# Altium schematic sheet boxer_analog.SchDoc: RS485, Buzzer, 12V FAN
size A4; DrawnBy: Damian Dolewski; Engineer: Damian Dolewski; DocumentNumber: 4; SheetNumber: 4; SheetTotal: 7
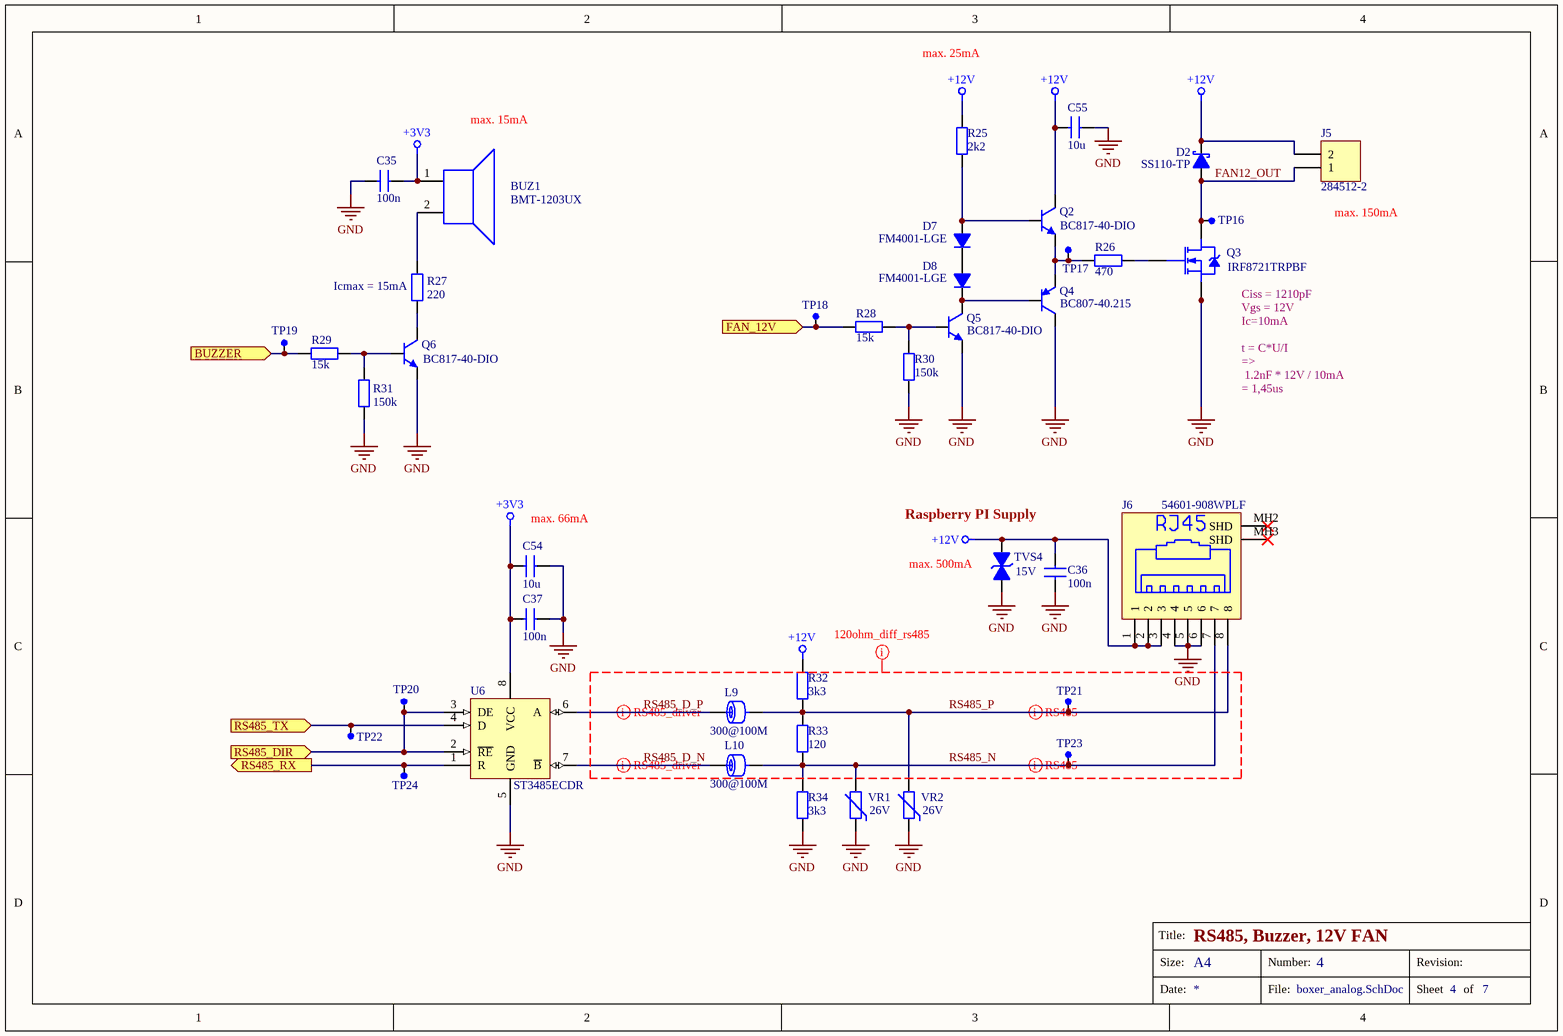
[diagram p0: boxer_analog.SchDoc]

## Parts
BUZ1  BMT-1203UX  [buzzer 7.6mm]
C35  value 100n  [C_0805]  (hidden comment: Capacitor)
C36  value 100n  [C_0805]  (hidden comment: Capacitor)
C37  value 100n  [C_0805]  (hidden comment: Capacitor)
C54  value 10u  [C_1206]  (hidden comment: TME: CL31A226MOCLNNC)
C55  value 10u  [C_1206]  (hidden comment: TME: CL31A226MOCLNNC)
D2  SS110-TP  [D_SMA]
D7  FM4001-LGE  [SOD123F]
D8  FM4001-LGE  [SOD123F]
J5  284512-2  [284512-2]
J6  54601-908WPLF  [RJ45_54601-908WPLF]
L9  value 300@100M  [L_0805]  (hidden comment: 742792031)
L10  value 300@100M  [L_0805]  (hidden comment: 742792031)
Q2  BC817-40-DIO  [SOT-23]
Q3  IRF8721TRPBF  [SO8]
Q4  BC807-40.215  [SOT-23]
Q5  BC817-40-DIO  [SOT-23]
Q6  BC817-40-DIO  [SOT-23]
R25  value 2k2  [R_0805]  (hidden comment: Resistor)
R26  value 470  [R_1206]  (hidden comment: Resistor)
R27  value 220  [R_0805]  (hidden comment: Resistor)
R28  value 15k  [R_0805]  (hidden comment: Resistor)
R29  value 15k  [R_0805]  (hidden comment: Resistor)
R30  value 150k  [R_0805]  (hidden comment: Resistor)
R31  value 150k  [R_0805]  (hidden comment: Resistor)
R32  value 3k3  [R_0805]  (hidden comment: Resistor)
R33  value 120  [R_0805]  (hidden comment: Resistor)
R34  value 3k3  [R_0805]  (hidden comment: Resistor)
TP16  TEST PAD  [PIN]  (value not drawn)
TP17  TEST PAD  [PIN]  (value not drawn)
TP18  TEST PAD  [PIN]  (value not drawn)
TP19  TEST PAD  [PIN]  (value not drawn)
TP20  TEST PAD  [PIN]  (value not drawn)
TP21  TEST PAD  [PIN]  (value not drawn)
TP22  TEST PAD  [PIN]  (value not drawn)
TP23  TEST PAD  [PIN]  (value not drawn)
TP24  TEST PAD  [PIN]  (value not drawn)
TVS4  value 15V  [D_SMB]  (hidden comment: SM6T15CA)
U6  ST3485ECDR  [SO8]
VR1  value 26V  [VR_0805]  (hidden comment: AMCV-0805-260-C800N-T)
VR2  value 26V  [VR_0805]  (hidden comment: AMCV-0805-260-C800N-T)

## Ports
BUZZER (in), FAN_12V (in), RS485_DIR (in), RS485_RX (out), RS485_TX (in)

## Nets
+3V3: BUZ1.1 C35.2 C37.1 C54.2 U6.8(VCC)
+12V: C36.1 C55.1 D2.2(K) J5.2 J6.1 J6.2 J6.3 Q2.3(C) R25.2 R32.2 TVS4.1(A)
GND: C35.1 C36.2 C37.2 C54.1 C55.2 J6.4 J6.5 J6.6 Q3.1(S) Q3.2(S) Q3.3(S) Q4.3(C) Q5.2(E) Q6.2(E) R30.1 R31.1 R34.1 TVS4.2(K) U6.5(GND) VR1.2 VR2.2
BUZZER: R29.1 TP19.1 ; port BUZZER
FAN12_OUT: D2.1(A) J5.1 Q3.5(D) Q3.6(D) Q3.7(D) Q3.8(D) TP16.1
FAN_12V: R28.1 TP18.1 ; port FAN_12V
RS485_D_N: L10.1 U6.7(~{B})
RS485_D_P: L9.1 U6.6(A)
RS485_DIR: TP20.1 U6.2(~{RE}) U6.3(DE) ; port RS485_DIR
RS485_N: J6.7 L10.2 R33.1 R34.2 TP23.1 VR1.1
RS485_P: J6.8 L9.2 R32.1 R33.2 TP21.1 VR2.1
RS485_RX: TP24.1 U6.1(R) ; port RS485_RX
RS485_TX: TP22.1 U6.4(D) ; port RS485_TX
NetBUZ1_2: BUZ1.2 R27.2
NetD7_1: D7.1(A) Q2.1(B) R25.1
NetD7_2: D7.2(K) D8.1(A)
NetD8_2: D8.2(K) Q4.1(B) Q5.3(C)
NetQ2_2: Q2.2(E) Q4.2(E) R26.2 TP17.1
NetQ3_4: Q3.4(G) R26.1
NetQ5_1: Q5.1(B) R28.2 R30.2
NetQ6_1: Q6.1(B) R29.2 R31.2
NetQ6_3: Q6.3(C) R27.1

Not connected (* = marked no-connect by the designer): J6 MH2(SHD)* MH3(SHD)*

## Layout directives
differential pair: RS485_D_N, RS485_D_P, RS485_N, RS485_P
net class 120ohm_diff_rs485; rule Impedance Constraint [Min = 115.0    Max = 125.0    ]: RS485_D_N, RS485_D_P, RS485_N, RS485_P

## Notes on the sheet
- max. 25mA
- max. 15mA
- (near J5) max. 150mA
- (near R27) Icmax = 15mA
- (near Q3) Ciss = 1210pF
  Vgs = 12V
  Ic=10mA
  t = C*U/I
  =>
  1.2nF * 12V / 10mA
  = 1,45us
- Raspberry PI Supply
- (near C54) max. 66mA
- (near TVS4) max. 500mA
- Title:
- Size:
- A4
- Number:
- Revision:
- Date:
- File:
- Sheet
- of

## Library data of the parts
BUZ1 = Buzzer: Value: BMT-1203UX
C54 C55 = Capacitor
D2 = Diode Schottky: Schottky Diode; Value: SS110-TP
D7 D8 = Diode: Value: FM4001-LGE
J5 = Header 2: Header, 2-Pin; Value: 284512-2
J6 = RJ45-8: RJ45 Socket, 8pin, No Key, Molex MX-95001-2881; Value: 54601-908WPLF
L9 L10 = FB: Ferrite Bead
Q2 Q5 Q6 = NPN: NPN Bipolar Transistor; Value: BC817-40-DIO
Q3 = MOSFET-N_SO8: N-Channel MOSFET; Value: IRF8721TRPBF
Q4 = PNP: Value: BC807-40.215
TP16-TP24 = TEST_PAD: PAD 1.5mm
TVS4 = Transil
U6 = ST485BDR: RS-422/RS-485 Interface IC Hi-Spd Lo Pwr Trans; ComponentLink1Description: Manufacturer Link; ComponentLink1URL: http://www.ti.com/; ComponentLink2Description: Datasheet; ComponentLink2URL: http://www-s.ti.com/sc/ds/sn75176b.pdf; Value: ST3485ECDR
VR1 VR2 = Varistor: 34.5V 20A Varistor 1 Circuit Surface Mount, MLCV 0805 (2012 Metric)